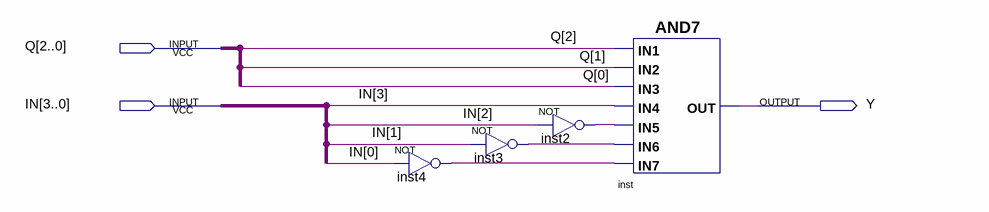
[diagram p0: schematic sheet]
// Quartus schematic OUTPUT_Y.bdf as structural Verilog: 4 symbols, 3 pins
module OUTPUT_Y (
  input  [2:0] Q,
  input  [3:0] IN,
  output Y
);

  wire inst2_out, inst3_out, inst4_out;

  not inst4 (inst4_out, IN[0]);
  not inst3 (inst3_out, IN[1]);
  not inst2 (inst2_out, IN[2]);
  and inst (Y, Q[2], Q[1], Q[0], IN[3], inst2_out, inst3_out, inst4_out);
endmodule
